# EAGLE schematic pc_healthypi_move_bottom_pcb_v3 (EAGLE 9.6.2)
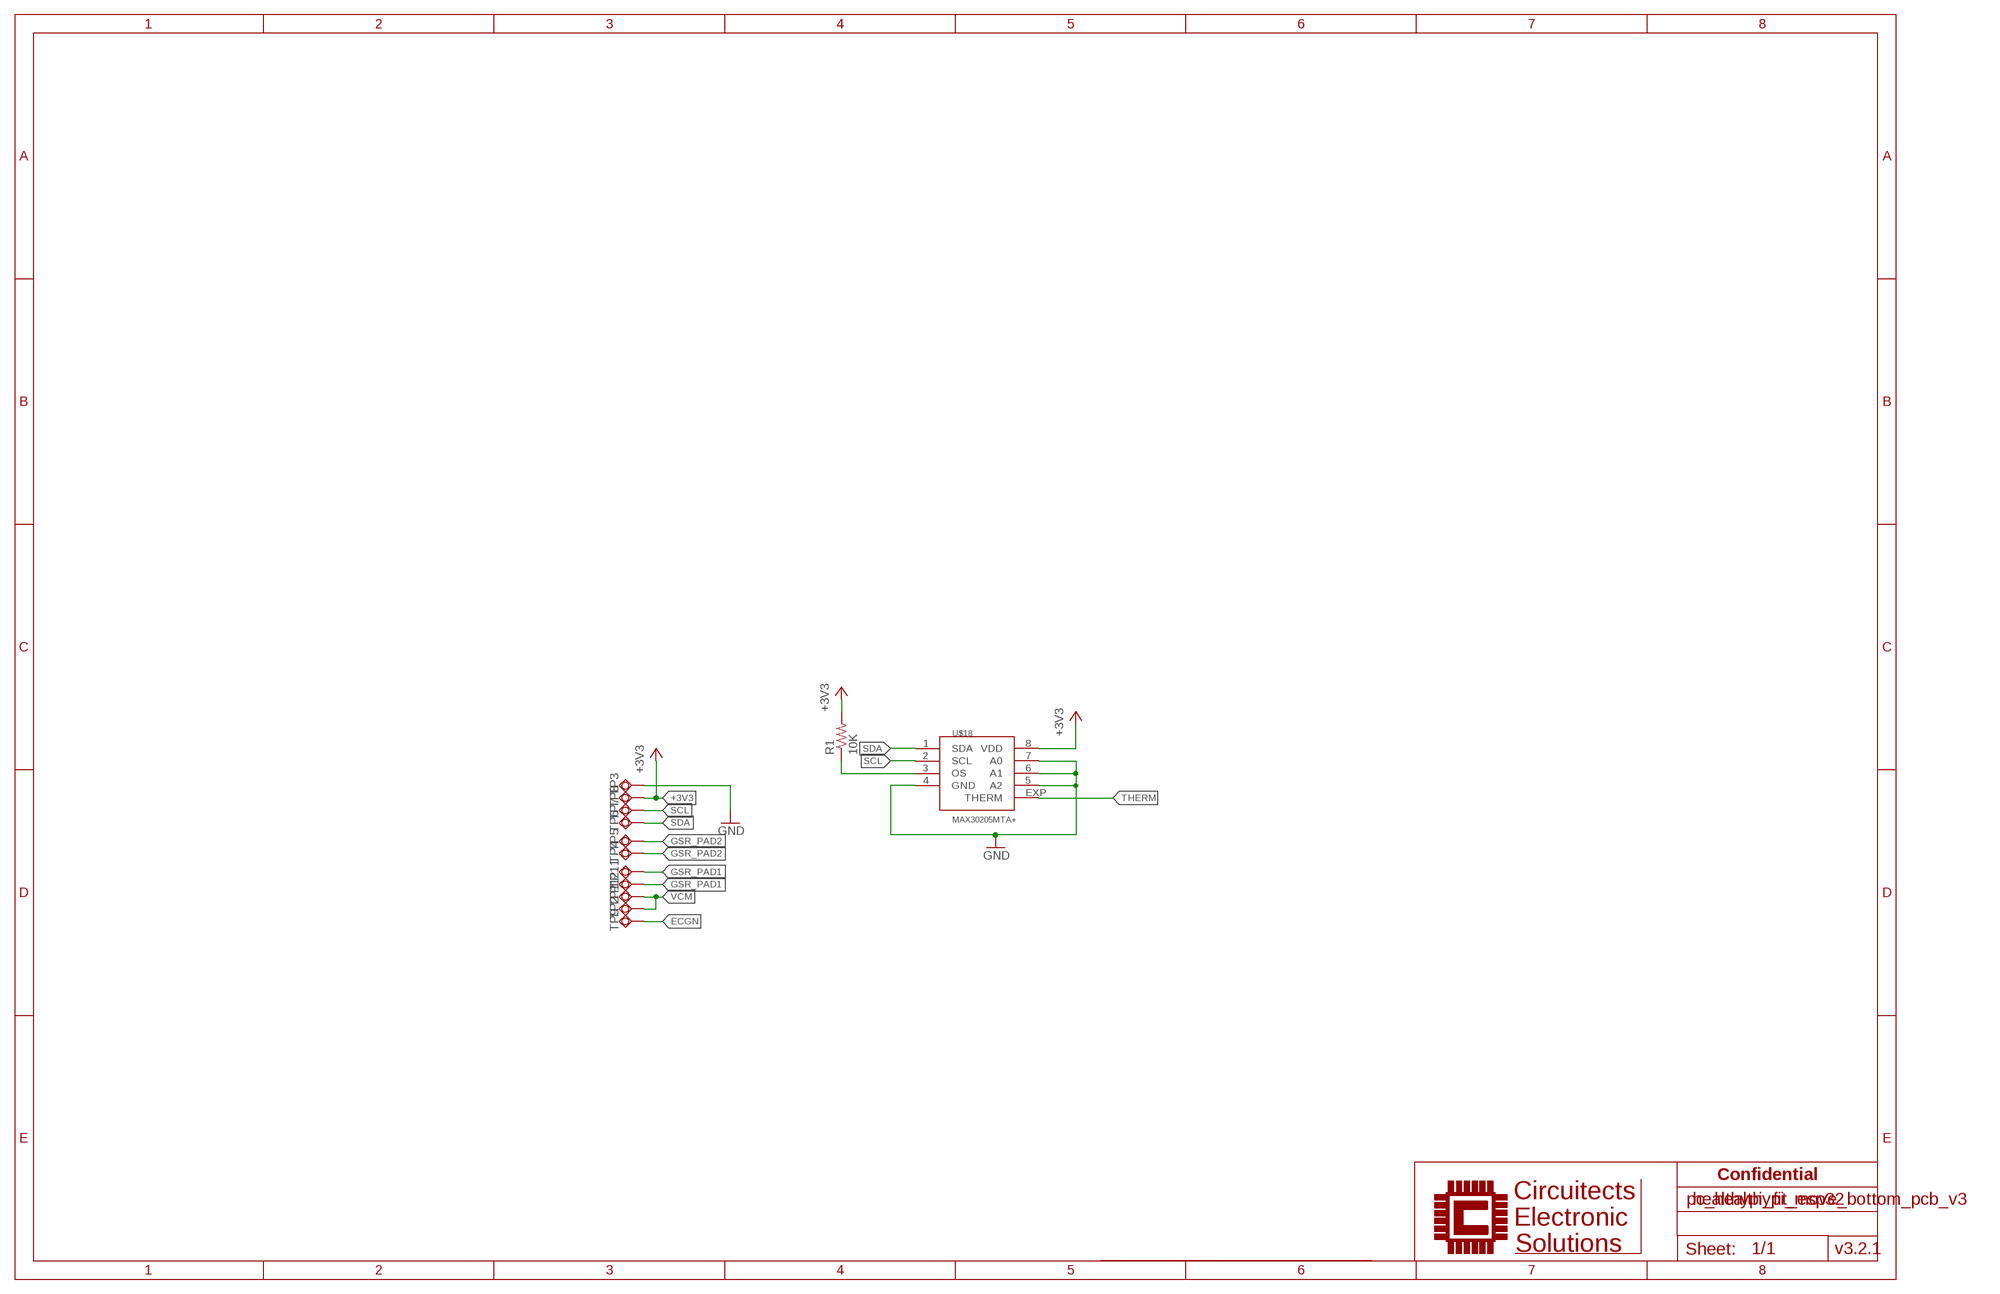
[diagram p0: schematic, sheet 1]

## Parts
R1  10K  R-US_R0201  [R0201]
TP1  TPSQTP20SQ  [TP20SQ]
TP2  TPSQTP20SQ  [TP20SQ]
TP3  TPSQTP20SQ  [TP20SQ]
TP4  TPSQTP20SQ  [TP20SQ]
TP5  TPSQTP20SQ  [TP20SQ]
TP6  TPSQTP20SQ  [TP20SQ]
TP7  TPSQTP20SQ  [TP20SQ]
TP8  TPSQTP20SQ  [TP20SQ]
TP9  TPSQTP20SQ  [TP20SQ]
TP11  TPSQTP20SQ  [TP20SQ]
TP12  TPSQTP20SQ  [TP20SQ]
U$18  MAX30205MTA+  [TDFN-08]

## Nets
+3V3: R1.2 TP8.TP U$18.8(VDD)
ECGN: TP9.TP
GND: TP3.TP U$18.4(GND) U$18.5(A2) U$18.6(A1) U$18.7(A0)
GSR_PAD1: TP11.TP TP12.TP
GSR_PAD2: TP4.TP TP5.TP
N$1: R1.1 U$18.3(OS)
SCL: TP7.TP U$18.2(SCL)
SDA: TP6.TP U$18.1(SDA)
THERM: U$18.EXP(THERM)
VCM: TP1.TP TP2.TP

## Notes on the sheet
- Confidential
- healthypi_fit_esp32
- v3.2.1

## Library data of the parts
R1 = rcl:R-US_: RESISTOR, American symbol; SPICEPREFIX: R
TP1-TP9 TP11 TP12 = testpad:TPSQ: Test pad
U$18 = circuitects:MAX30205

## Net classes
2 Clock: width 0.089 mm, clearance 0.178 mm